# EAGLE schematic Receiver (EAGLE 6.1)
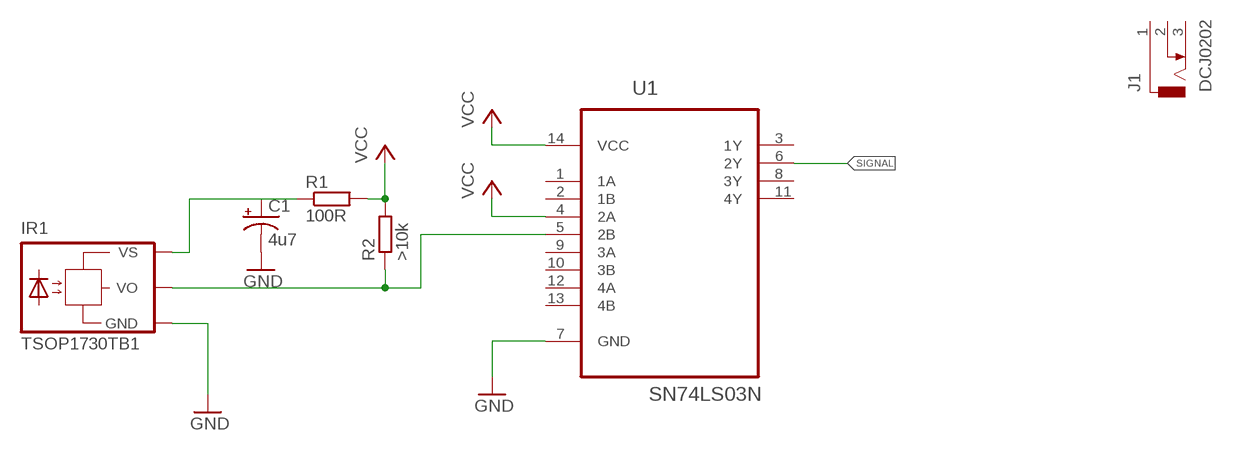
[diagram p0: schematic, sheet 1]

## Parts
C1  4u7  CPOL-USE2-4  [E2-4]
IR1  TSOP1730TB1  [TSOP17_TB1]
J1  DCJ0202  [DCJ0202]
R1  100R  R-EU_0204/5  [0204/5]
R2  >10k  R-EU_0204/5  [0204/5]
U1  SN74LS03N  [DIP254P762X508-14]

## Nets
GND: C1.- IR1.GND U1.7(GND)
N$2: IR1.VO R2.1 U1.5(2B)
N$3: C1.+ IR1.VS R1.1
SIGNAL: U1.6(2Y)
VCC: R1.2 R2.2 U1.4(2A) U1.14(VCC)
Unconnected: J1.1 J1.2 J1.3 U1.1(1A) U1.2(1B) U1.3(1Y) U1.8(3Y) U1.9(3A) U1.10(3B) U1.11(4Y) U1.12(4A) U1.13(4B)

## Library data of the parts
C1 = adafruit:CPOL-US: POLARIZED CAPACITOR, American symbol
IR1 = telefunken:TSOP17*TB1: TSOP17..TB1 IR Receiver Modules for Remote Control Systems Source: http://www.vishay.com/docs/82042/82042.pdf; OC_FARNELL: unknown; OC_NEWARK: unknown
J1 = con-jack:DCJ0202: DC POWER JACK Source: DCJ0202.pdf; OC_FARNELL: unknown; OC_NEWARK: unknown
R1 R2 = rcl:R-EU_: RESISTOR, European symbol
U1 = Texas Instruments_By_element14_Batch_1:SN74LS03N: QUADRUPLE 2-INPUT POSITIVE-NAND GATES; MPN: SN74LS03N; OC_FARNELL: 1607821; OC_NEWARK: 60K6849; PACKAGE: DIP-14; SUPPLIER: Texas Instruments